# Altium schematic sheet photodiodes.SchDoc
size 457 x 241 mm; SheetNumber: 3; SheetTotal: 4
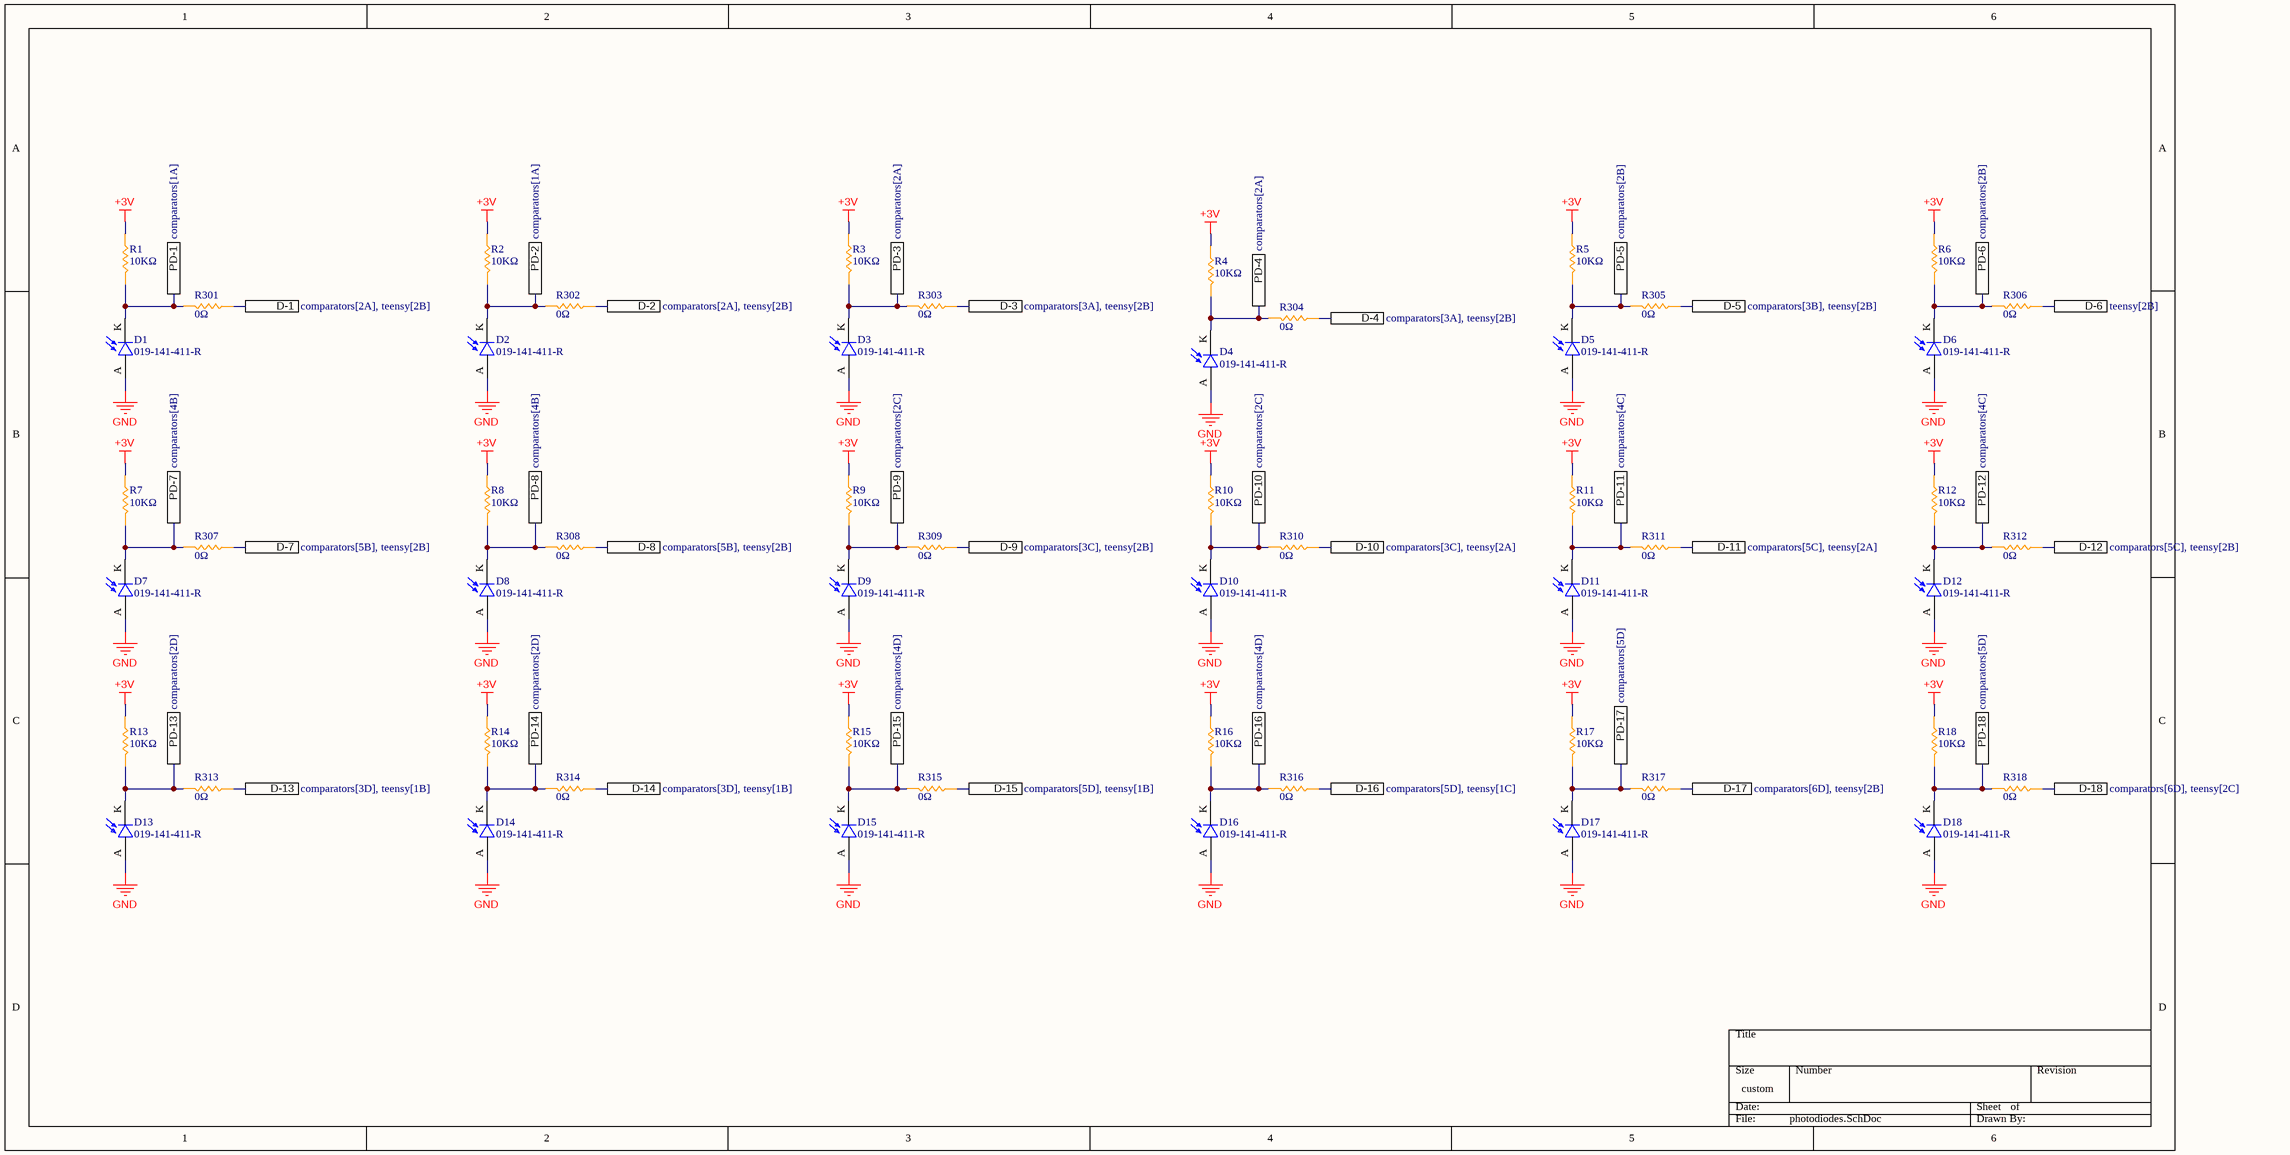
[diagram p0: photodiodes.SchDoc]

## Parts
D1  019-141-411-R  [DIOC2012X80N]
D2  019-141-411-R  [DIOC2012X80N]
D3  019-141-411-R  [DIOC2012X80N]
D4  019-141-411-R  [DIOC2012X80N]
D5  019-141-411-R  [DIOC2012X80N]
D6  019-141-411-R  [DIOC2012X80N]
D7  019-141-411-R  [DIOC2012X80N]
D8  019-141-411-R  [DIOC2012X80N]
D9  019-141-411-R  [DIOC2012X80N]
D10  019-141-411-R  [DIOC2012X80N]
D11  019-141-411-R  [DIOC2012X80N]
D12  019-141-411-R  [DIOC2012X80N]
D13  019-141-411-R  [DIOC2012X80N]
D14  019-141-411-R  [DIOC2012X80N]
D15  019-141-411-R  [DIOC2012X80N]
D16  019-141-411-R  [DIOC2012X80N]
D17  019-141-411-R  [DIOC2012X80N]
D18  019-141-411-R  [DIOC2012X80N]
R1  10KΩ  [RES_0603]
R2  10KΩ  [RES_0603]
R3  10KΩ  [RES_0603]
R4  10KΩ  [RES_0603]
R5  10KΩ  [RES_0603]
R6  10KΩ  [RES_0603]
R7  10KΩ  [RES_0603]
R8  10KΩ  [RES_0603]
R9  10KΩ  [RES_0603]
R10  10KΩ  [RES_0603]
R11  10KΩ  [RES_0603]
R12  10KΩ  [RES_0603]
R13  10KΩ  [RES_0603]
R14  10KΩ  [RES_0603]
R15  10KΩ  [RES_0603]
R16  10KΩ  [RES_0603]
R17  10KΩ  [RES_0603]
R18  10KΩ  [RES_0603]
R301  0Ω  [RES_0603]
R302  0Ω  [RES_0603]
R303  0Ω  [RES_0603]
R304  0Ω  [RES_0603]
R305  0Ω  [RES_0603]
R306  0Ω  [RES_0603]
R307  0Ω  [RES_0603]
R308  0Ω  [RES_0603]
R309  0Ω  [RES_0603]
R310  0Ω  [RES_0603]
R311  0Ω  [RES_0603]
R312  0Ω  [RES_0603]
R313  0Ω  [RES_0603]
R314  0Ω  [RES_0603]
R315  0Ω  [RES_0603]
R316  0Ω  [RES_0603]
R317  0Ω  [RES_0603]
R318  0Ω  [RES_0603]

## Ports
D-1 (see comparators[2A], teensy[2B]), D-2 (see comparators[2A], teensy[2B]), D-3 (see comparators[3A], teensy[2B]), D-4 (see comparators[3A], teensy[2B]), D-5 (see comparators[3B], teensy[2B]), D-6 (see teensy[2B]), D-7 (see comparators[5B], teensy[2B]), D-8 (see comparators[5B], teensy[2B]), D-9 (see comparators[3C], teensy[2B]), D-10 (see comparators[3C], teensy[2A]), D-11 (see comparators[5C], teensy[2A]), D-12 (see comparators[5C], teensy[2B]), D-13 (see comparators[3D], teensy[1B]), D-14 (see comparators[3D], teensy[1B]), D-15 (see comparators[5D], teensy[1B]), D-16 (see comparators[5D], teensy[1C]), D-17 (see comparators[6D], teensy[2B]), D-18 (see comparators[6D], teensy[2C]), PD-1 (see comparators[1A]), PD-2 (see comparators[1A]), PD-3 (see comparators[2A]), PD-4 (see comparators[2A]), PD-5 (see comparators[2B]), PD-6 (see comparators[2B]), PD-7 (see comparators[4B]), PD-8 (see comparators[4B]), PD-9 (see comparators[2C]), PD-10 (see comparators[2C]), PD-11 (see comparators[4C]), PD-12 (see comparators[4C]), PD-13 (see comparators[2D]), PD-14 (see comparators[2D]), PD-15 (see comparators[4D]), PD-16 (see comparators[4D]), PD-17 (see comparators[5D]), PD-18 (see comparators[5D])

## Nets
+3V: R1.2 R2.2 R3.2 R4.2 R5.2 R6.2 R7.2 R8.2 R9.2 R10.2 R11.2 R12.2 R13.2 R14.2 R15.2 R16.2 R17.2 R18.2
GND: D1.A D2.A D3.A D4.A D5.A D6.A D7.A D8.A D9.A D10.A D11.A D12.A D13.A D14.A D15.A D16.A D17.A D18.A
D-1: R301.2 ; port D-1
D-2: R302.2 ; port D-2
D-3: R303.2 ; port D-3
D-4: R304.2 ; port D-4
D-5: R305.2 ; port D-5
D-6: R306.2 ; port D-6
D-7: R307.2 ; port D-7
D-8: R308.2 ; port D-8
D-9: R309.2 ; port D-9
D-10: R310.2 ; port D-10
D-11: R311.2 ; port D-11
D-12: R312.2 ; port D-12
D-13: R313.2 ; port D-13
D-14: R314.2 ; port D-14
D-15: R315.2 ; port D-15
D-16: R316.2 ; port D-16
D-17: R317.2 ; port D-17
D-18: R318.2 ; port D-18
PD-1: D1.K(C) R1.1 R301.1 ; port PD-1
PD-2: D2.K(C) R2.1 R302.1 ; port PD-2
PD-3: D3.K(C) R3.1 R303.1 ; port PD-3
PD-4: D4.K(C) R4.1 R304.1 ; port PD-4
PD-5: D5.K(C) R5.1 R305.1 ; port PD-5
PD-6: D6.K(C) R6.1 R306.1 ; port PD-6
PD-7: D7.K(C) R7.1 R307.1 ; port PD-7
PD-8: D8.K(C) R8.1 R308.1 ; port PD-8
PD-9: D9.K(C) R9.1 R309.1 ; port PD-9
PD-10: D10.K(C) R10.1 R310.1 ; port PD-10
PD-11: D11.K(C) R11.1 R311.1 ; port PD-11
PD-12: D12.K(C) R12.1 R312.1 ; port PD-12
PD-13: D13.K(C) R13.1 R313.1 ; port PD-13
PD-14: D14.K(C) R14.1 R314.1 ; port PD-14
PD-15: D15.K(C) R15.1 R315.1 ; port PD-15
PD-16: D16.K(C) R16.1 R316.1 ; port PD-16
PD-17: D17.K(C) R17.1 R317.1 ; port PD-17
PD-18: D18.K(C) R18.1 R318.1 ; port PD-18

## Library data of the parts
D1-D18 = 019-141-411-R: PHOTODIODE RED MICRO SMT; MF: Advanced Photonix; Price: None; Check_prices: https://www.snapeda.com/parts/019-141-411-R/Advanced%20Photonix/view-part/5167997/?ref=eda; Value: *; Purchase-URL: https://pricing.snapeda.com/search/part/019-141-411-R/?ref=eda; Package: None; SnapEDA_Link: https://www.snapeda.com/parts/019-141-411-R/Advanced%20Photonix/view-part/5167997/?ref=snap; MP: 019-141-411-R; Availability: Warning
R1-R18 R301-R318 = RES_0603: Resistor SMD 0603 generic